# EAGLE schematic ECE_362_mini_project (EAGLE 7.5.0)
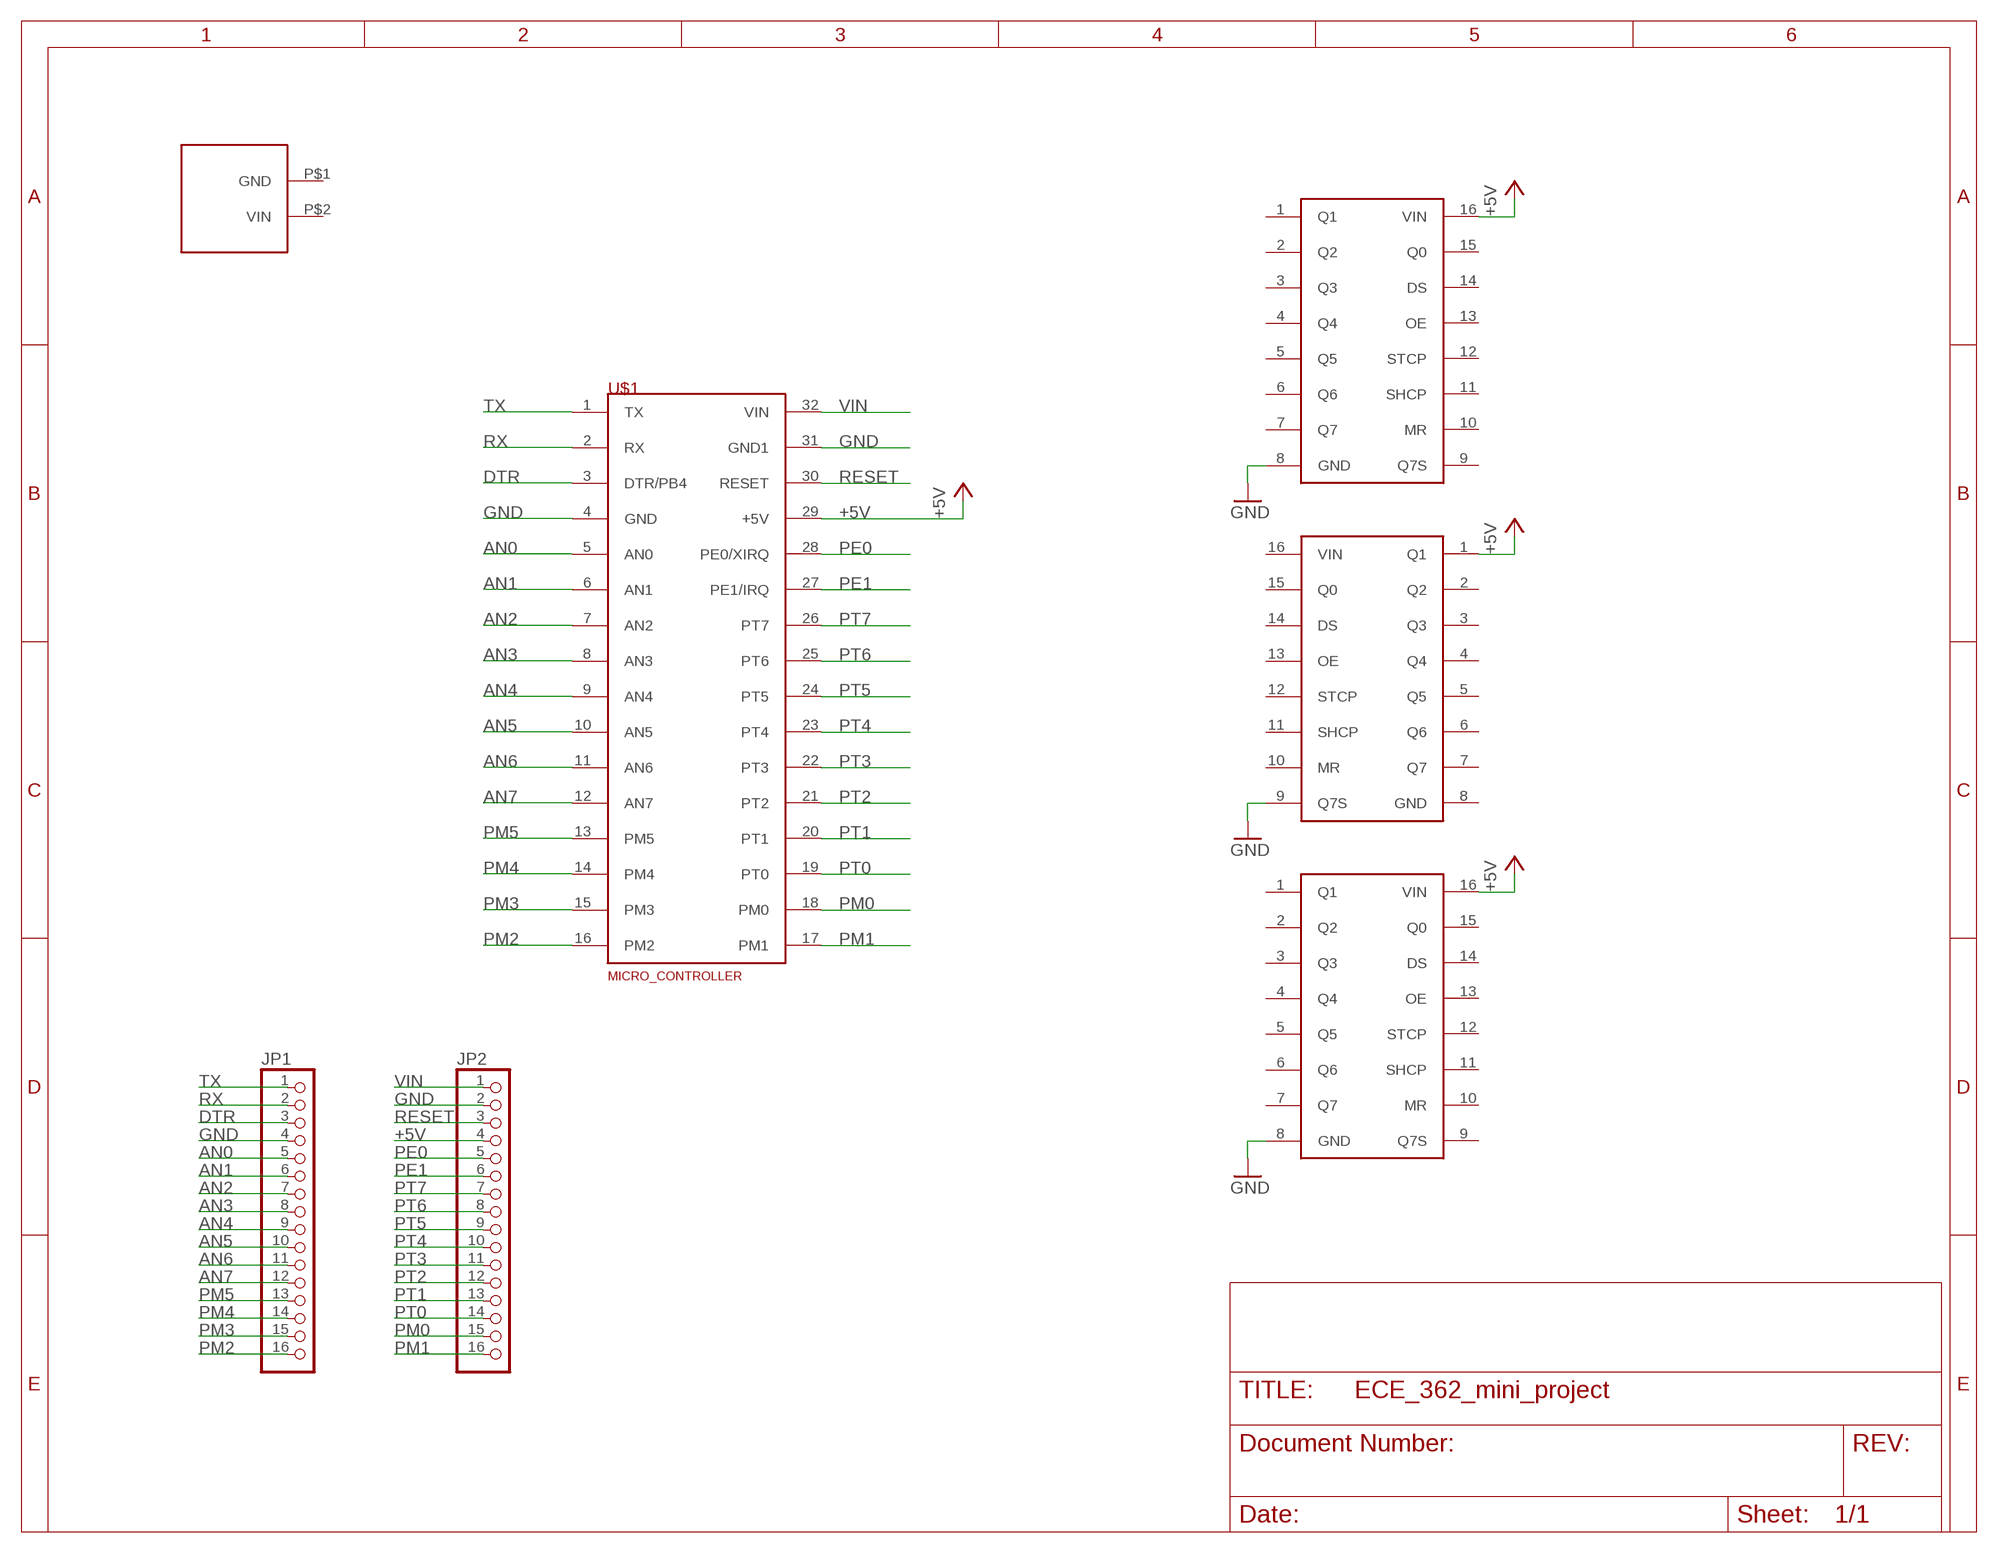
[diagram p0: schematic, sheet 1]

## Parts
JP1  PINHD-1X16  [1X16]
JP2  PINHD-1X16  [1X16]
U$1  MICRO_CONTROLLER  [MICRO_CONTROLLER]
U$2  SHIFT_REGISTER  [N5]
U$3  XT60  [XT60]
U$4  SHIFT_REGISTER  [N5]
U$5  SHIFT_REGISTER  [N5]

## Nets
+5V: JP2.4 U$1.29(+5V) U$2.16(VIN) U$4.1(Q1) U$5.16(VIN)
AN0: JP1.5 U$1.5(AN0)
AN1: JP1.6 U$1.6(AN1)
AN2: JP1.7 U$1.7(AN2)
AN3: JP1.8 U$1.8(AN3)
AN4: JP1.9 U$1.9(AN4)
AN5: JP1.10 U$1.10(AN5)
AN6: JP1.11 U$1.11(AN6)
AN7: JP1.12 U$1.12(AN7)
DTR: JP1.3 U$1.3(DTR/PB4)
GND: JP1.4 JP2.2 U$1.4(GND) U$1.31(GND1) U$2.8(GND) U$4.9(Q7S) U$5.8(GND)
PE0: JP2.5 U$1.28(PE0/XIRQ)
PE1: JP2.6 U$1.27(PE1/IRQ)
PM0: JP2.15 U$1.18(PM0)
PM1: JP2.16 U$1.17(PM1)
PM2: JP1.16 U$1.16(PM2)
PM3: JP1.15 U$1.15(PM3)
PM4: JP1.14 U$1.14(PM4)
PM5: JP1.13 U$1.13(PM5)
PT0: JP2.14 U$1.19(PT0)
PT1: JP2.13 U$1.20(PT1)
PT2: JP2.12 U$1.21(PT2)
PT3: JP2.11 U$1.22(PT3)
PT4: JP2.10 U$1.23(PT4)
PT5: JP2.9 U$1.24(PT5)
PT6: JP2.8 U$1.25(PT6)
PT7: JP2.7 U$1.26(PT7)
RESET: JP2.3 U$1.30(RESET)
RX: JP1.2 U$1.2(RX)
TX: JP1.1 U$1.1(TX)
VIN: JP2.1 U$1.32(VIN)
Unconnected: U$2.1(Q1) U$2.2(Q2) U$2.3(Q3) U$2.4(Q4) U$2.5(Q5) U$2.6(Q6) U$2.7(Q7) U$2.9(Q7S) U$2.10(MR) U$2.11(SHCP) U$2.12(STCP) U$2.13(OE) U$2.14(DS) U$2.15(Q0) U$3.P$1(GND) U$3.P$2(VIN) U$4.2(Q2) U$4.3(Q3) U$4.4(Q4) U$4.5(Q5) U$4.6(Q6) U$4.7(Q7) U$4.8(GND) U$4.10(MR) U$4.11(SHCP) U$4.12(STCP) U$4.13(OE) U$4.14(DS) U$4.15(Q0) U$4.16(VIN) U$5.1(Q1) U$5.2(Q2) U$5.3(Q3) U$5.4(Q4) U$5.5(Q5) U$5.6(Q6) U$5.7(Q7) U$5.9(Q7S) U$5.10(MR) U$5.11(SHCP) U$5.12(STCP) U$5.13(OE) U$5.14(DS) U$5.15(Q0)

## Library data of the parts
JP1 JP2 = mini_project_parts:PINHD-1X16: PIN HEADER
U$1 = mini_project_parts:MICRO_CONTROLLER
U$2 U$4 U$5 = mini_project_parts:SHIFT_REGISTER
U$3 = mini_project_parts:XT60